# EAGLE design hair_comb (EAGLE 6.6.0)
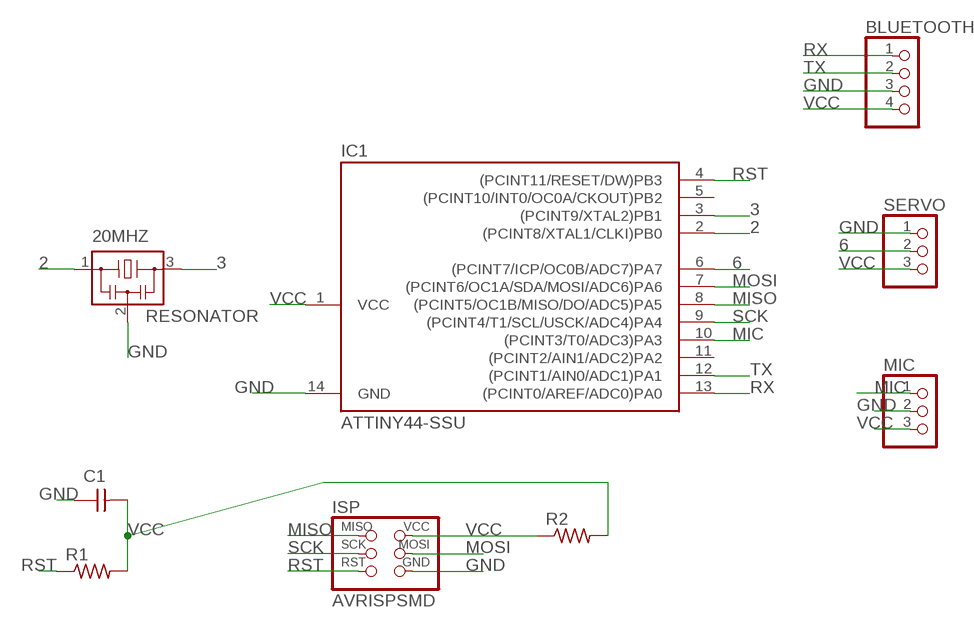
[diagram p0: schematic, sheet 1]

## Parts
20MHZ  RESONATOR  [EFOBM]
BLUETOOTH  PINHD-1X4/90  [1X04/90]
C1  CAP-UNPOLARIZEDFAB  [C1206FAB]
IC1  ATTINY44-SSU  [SOIC14]
ISP  AVRISPSMD  [2X03SMD]
MIC  PINHD-1X3/90  [1X03/90]
R1  RES-US1206FAB  [R1206FAB]
R2  RES-US1206FAB  [R1206FAB]
SERVO  PINHD-1X3/90  [1X03/90]

## Nets
2: 20MHZ.1 IC1.2((PCINT8/XTAL1/CLKI)PB0)
3: 20MHZ.3 IC1.3((PCINT9/XTAL2)PB1)
6: IC1.6((PCINT7/ICP/OC0B/ADC7)PA7) SERVO.2
GND: 20MHZ.2 BLUETOOTH.3 C1.1 IC1.14(GND) ISP.6(GND) MIC.2 SERVO.1
MIC: IC1.10((PCINT3/T0/ADC3)PA3) MIC.1
MISO: IC1.8((PCINT5/OC1B/MISO/DO/ADC5)PA5) ISP.1(MISO)
MOSI: IC1.7((PCINT6/OC1A/SDA/MOSI/ADC6)PA6) ISP.4(MOSI)
RST: IC1.4((PCINT11/RESET/DW)PB3) ISP.5(RST) R1.1
RX: BLUETOOTH.1 IC1.13((PCINT0/AREF/ADC0)PA0)
SCK: IC1.9((PCINT4/T1/SCL/USCK/ADC4)PA4) ISP.3(SCK)
TX: BLUETOOTH.2 IC1.12((PCINT1/AIN0/ADC1)PA1)
VCC: BLUETOOTH.4 C1.2 IC1.1(VCC) ISP.2(VCC) MIC.3 R1.2 R2.1 R2.2 SERVO.3
Unconnected: IC1.5((PCINT10/INT0/OC0A/CKOUT)PB2) IC1.11((PCINT2/AIN1/ADC2)PA2)

## Library data of the parts
20MHZ = fab:RESONATOR
BLUETOOTH = pinhead:PINHD-1X4: PIN HEADER
C1 = fab:CAP-UNPOLARIZED
IC1 = fab:ATTINY44
ISP = fab:AVRISP
MIC SERVO = pinhead:PINHD-1X3: PIN HEADER
R1 R2 = fab:RES-US: Resistor (US Symbol) Variants with postfix FAB are widened to allow the routing of internal traces

## Board
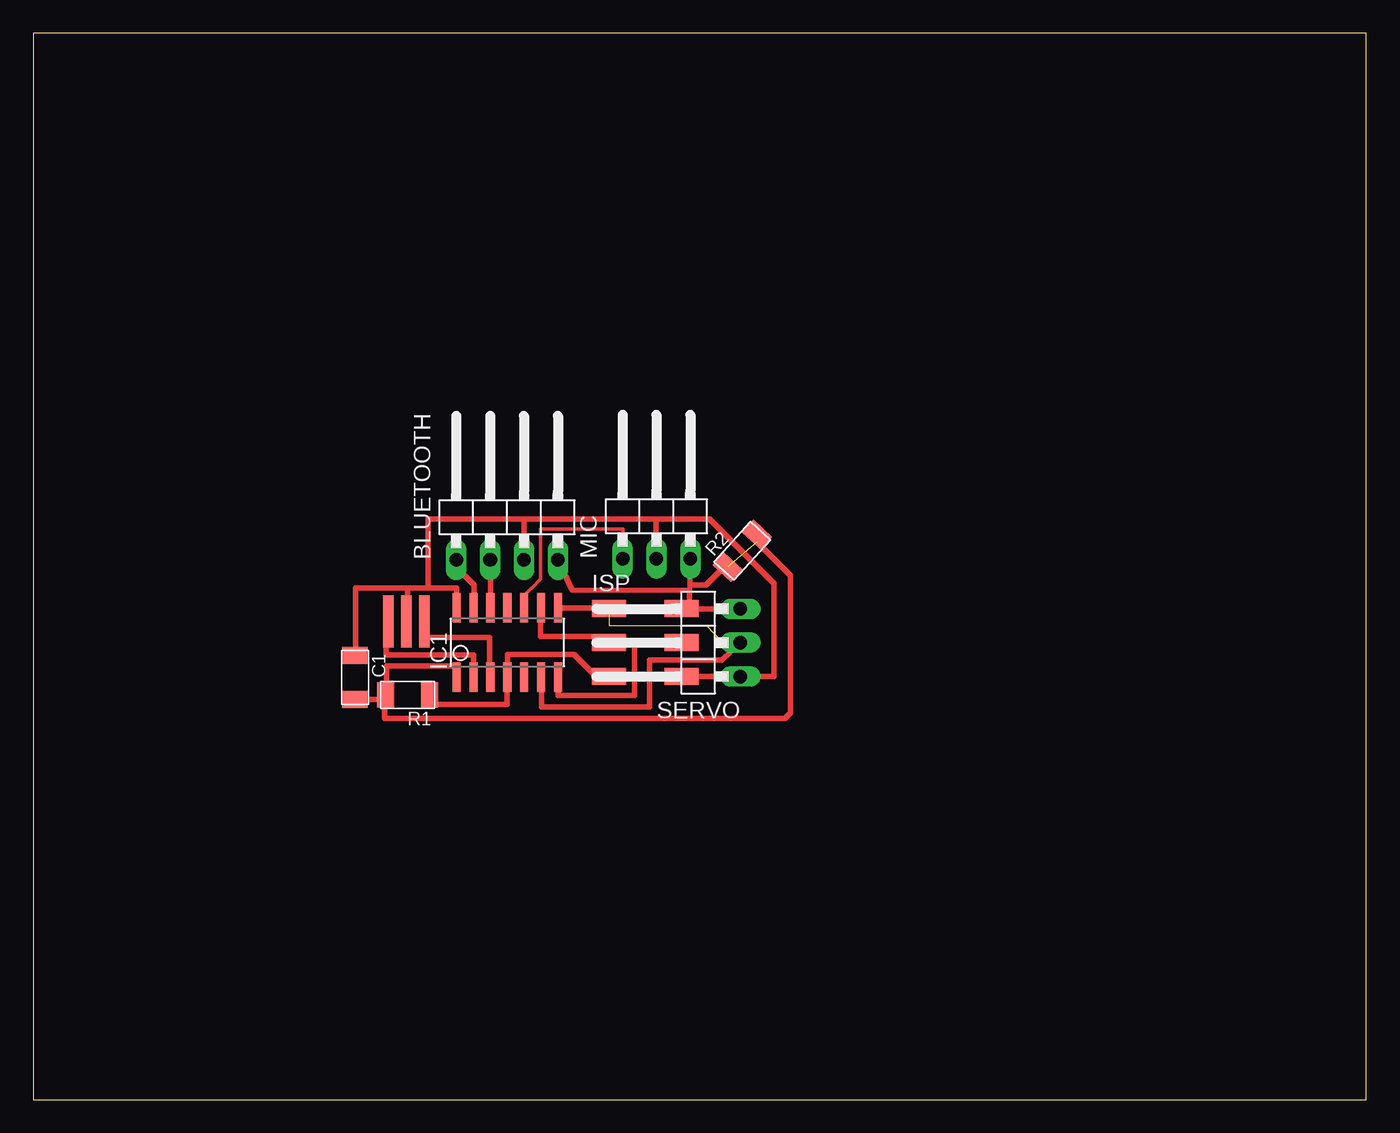
[diagram p1: board, top side]

Size 100 x 80 mm. Coordinates in mm from the lower left corner, seen from the top.
Outline: 0,0 100,0 100,80 0,80 0,0
Copper layers (1*16): Top 0.035mm / dielectric 1.5mm / Bottom 0.035mm
Design rules "default *": minimum track width 16mil, minimum drill 24mil, track to track 0.34mm, track to pad 0.34mm, pad to pad 16mil, via to via 16mil, smd to smd 16mil, copper to edge 40mil, drill to drill 8mil, minimum pad ring 10mil, minimum via ring 8mil, stop-mask expansion 4mil, vias tented up to drill 0mil, thermal gap 10mil

### Footprints (pad centres in the part's own frame; a part is rotated, then mirrored left to right if it is on the bottom)
EFOBM = smd 0.8 x 3.9: 1 -1.35,0; 2 0,0; 3 1.35,0
1X04/90 = drill 1.016 long: 1 -3.81,-3.81; 2 -1.27,-3.81; 3 1.27,-3.81; 4 3.81,-3.81
C1206FAB = smd 1.27 x 1.905: 1 -1.651,0; 2 1.651,0
SOIC14 = smd 0.61 x 2.21: 1 -3.81,-2.603; 2 -2.54,-2.603; 3 -1.27,-2.603; 4 0,-2.603; 5 1.27,-2.603; 6 2.54,-2.603; 7 3.81,-2.603; 8 3.81,2.603; 9 2.54,2.603; 10 1.27,2.603; 11 0,2.603; 12 -1.27,2.603; 13 -2.54,2.603; 14 -3.81,2.603
2X03SMD = smd 2.54 x 1.27: 1 -2.54,2.54; 2 2.92,2.54; 3 -2.54,0; 4 2.92,0; 5 -2.54,-2.54; 6 2.92,-2.54
1X03/90 = drill 1.016 long: 1 -2.54,-3.81; 2 0,-3.81; 3 2.54,-3.81
R1206FAB = smd 1.27 x 1.905: 1 -1.651,0; 2 1.651,0

### Placement (x,y rotation side)
20MHZ  27.98,35.87 0 top
BLUETOOTH  35.54,44.32 0 top
C1  24.13,31.68 270 top
IC1  35.56,34.29 0 top
ISP  45.72,34.29 0 top
MIC  46.75,44.4 0 top
R1  28.09,30.36 180 top
R2  53.19,41.17 47.8 top
SERVO  49.24,34.28 90 top

### Tracks (layer width: path | path; a pad name or v marks a point on that pad's centre or on a via)
2
  Top 0.406: 20MHZ.1 26.45,35.81 26.45,33.35 33.02,33.35 IC1.2
3
  Top 0.406: IC1.3 34.22,31.69 34.22,34.68 29.26,34.68 20MHZ.3
6
  Top 0.406: IC1.6 38.14,31.69 38.14,29.45 46.22,29.45 46.23,32.98 51.68,32.98 SERVO.2
GND
  Top 0.406: ISP.6 SERVO.1 55.58,31.74 55.58,38.72 50.73,43.57 46.7,43.57 | C1.1 24.19,33.33 24.19,38.38 28.08,38.38 | 28.08,38.38 29.62,38.38 | IC1.14 31.75,38.38 29.62,38.38 | 20MHZ.2 28.1,35.65 28.08,38.38 | 29.62,38.38 29.62,43.57 36.81,43.57 | 36.81,43.57 46.7,43.57 | MIC.2 46.75,40.45 46.7,40.45 46.7,43.57 | BLUETOOTH.3 36.81,43.57
MIC
  Top 0.254: MIC.1 44.23,42.82 38.06,42.82 38.06,39.05 37.37,38.36 37.36,38.36 36.84,37.84 36.84,36.9 IC1.10
MISO  (3 unrouted)
  Top 0.406: IC1.8 43.18,36.89 ISP.1 | 51.76,34.26 53.03,34.26
MOSI
  Top 0.406: IC1.7 39.37,30.33 45.11,30.33 45.11,34.29 ISP.4
RST
  Top 0.406: ISP.5 43.13,31.7 42.25,31.7 40.55,33.4 35.59,33.4 35.59,31.69 IC1.4 35.56,29.64 29.42,29.64 29.42,30.31 R1.1
RX
  Top 0.406: BLUETOOTH.1 31.73,39.96 33.07,38.62 33.07,36.94 IC1.13
SCK
  Top 0.406: IC1.9 38.06,36.89 38.06,34.73 43.18,34.73 ISP.3
TX
  Top 0.406: IC1.12 34.29,40.49 BLUETOOTH.2
VCC  (1 unrouted)
  Top 0.406: ISP.2 49.25,36.82 | 49.25,36.82 SERVO.3 | C1.2 26.35,30.03 | IC1.1 31.75,32.38 31.77,32.38 31.77,32.52 26.5,32.52 26.5,30.36 R1.2 26.44,30.03 26.35,30.03 | MIC.3 49.25,40.59 49.25,38.61 | 49.25,38.61 49.23,38.2 | 49.23,38.2 49.25,36.82 | BLUETOOTH.4 40.42,38.25 49.23,38.2 | R2.2 54.3,42.22 | R2.1 51.83,39.95 50.48,38.6 49.26,38.6 49.25,38.61 | 54.3,42.22 54.3,41.83 56.81,39.32 56.81,29 56.39,28.58 26.35,28.58 26.35,30.03 | 54.3,42.22 54.16,42.36